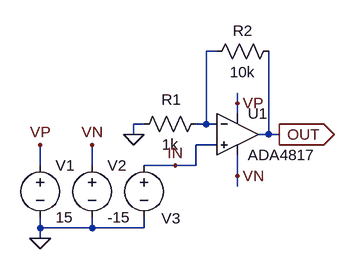
[diagram p0: schematic compile.asc]
compile.asc, the LTspice schematic file:
Version 4
SHEET 1 880 680
WIRE 288 -32 272 -32
WIRE 320 48 320 32
WIRE 320 64 320 48
WIRE 176 80 160 80
WIRE 272 80 272 -32
WIRE 272 80 256 80
WIRE 288 80 272 80
WIRE 160 96 160 80
WIRE 368 96 368 -32
WIRE 368 96 352 96
WIRE 384 96 368 96
WIRE 288 112 256 112
WIRE 16 144 16 112
WIRE 96 144 96 112
WIRE 224 144 176 144
WIRE 256 144 256 112
WIRE 256 144 224 144
WIRE 320 160 320 128
WIRE 320 176 320 160
WIRE 16 240 16 224
WIRE 96 240 96 224
WIRE 96 240 16 240
WIRE 176 240 176 224
WIRE 176 240 96 240
WIRE 16 256 16 240
FLAG 160 96 0
FLAG 16 256 0
FLAG 384 96 OUT
IOPIN 384 96 Out
FLAG 320 48 VP
FLAG 16 112 VP
FLAG 96 112 VN
FLAG 320 160 VN
FLAG 224 144 IN
SYMBOL OpAmps/ADA4817 320 32 R0
SYMATTR InstName U1
SYMBOL voltage 16 128 R0
WINDOW 123 0 0 Left 0
WINDOW 39 0 0 Left 0
SYMATTR InstName V1
SYMATTR Value 15
SYMBOL voltage 96 128 R0
WINDOW 123 0 0 Left 0
WINDOW 39 0 0 Left 0
SYMATTR InstName V2
SYMATTR Value -15
SYMBOL voltage 176 128 R0
WINDOW 123 24 124 Left 2
WINDOW 39 0 0 Left 0
WINDOW 3 24 44 Left 2
WINDOW 0 27 97 Left 2
SYMATTR Value ""
SYMATTR InstName V3
SYMBOL res 272 64 R90
WINDOW 0 -6 54 VBottom 2
WINDOW 3 32 56 VTop 2
SYMATTR InstName R1
SYMATTR Value 1k
SYMBOL res 384 -48 R90
WINDOW 0 0 56 VBottom 2
WINDOW 3 32 56 VTop 2
SYMATTR InstName R2
SYMATTR Value 10k

The netlist it stands for:
* compile.asc
XU1 IN N001 VP VN OUT ADA4817  ; pins In+ In- V+ V- OUT
V1 VP 0 15
V2 VN 0 -15
V3 IN 0
R1 N001 0 1k
R2 OUT N001 10k
.backanno
.end